# Altium schematic sheet R.SchDoc
size A4
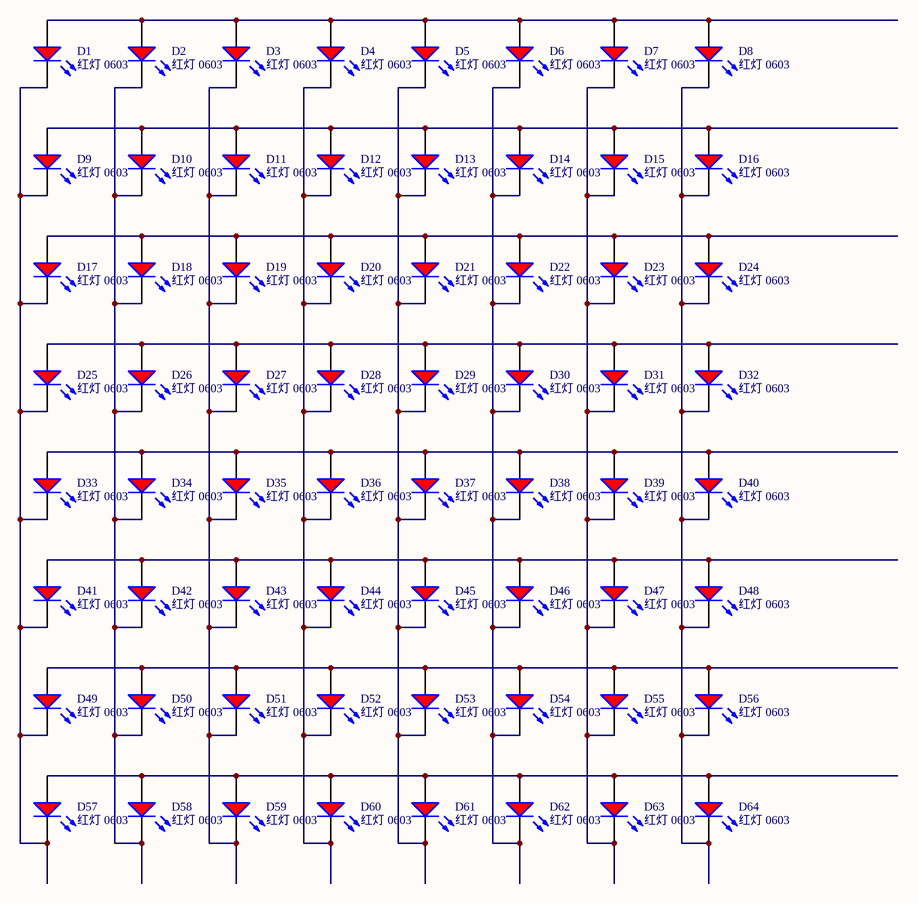
[diagram p0: R.SchDoc]

## Parts
D1  红灯 0603  [0603_LED_S1]
D2  红灯 0603  [0603_LED_S1]
D3  红灯 0603  [0603_LED_S1]
D4  红灯 0603  [0603_LED_S1]
D5  红灯 0603  [0603_LED_S1]
D6  红灯 0603  [0603_LED_S1]
D7  红灯 0603  [0603_LED_S1]
D8  红灯 0603  [0603_LED_S1]
D9  红灯 0603  [0603_LED_S1]
D10  红灯 0603  [0603_LED_S1]
D11  红灯 0603  [0603_LED_S1]
D12  红灯 0603  [0603_LED_S1]
D13  红灯 0603  [0603_LED_S1]
D14  红灯 0603  [0603_LED_S1]
D15  红灯 0603  [0603_LED_S1]
D16  红灯 0603  [0603_LED_S1]
D17  红灯 0603  [0603_LED_S1]
D18  红灯 0603  [0603_LED_S1]
D19  红灯 0603  [0603_LED_S1]
D20  红灯 0603  [0603_LED_S1]
D21  红灯 0603  [0603_LED_S1]
D22  红灯 0603  [0603_LED_S1]
D23  红灯 0603  [0603_LED_S1]
D24  红灯 0603  [0603_LED_S1]
D25  红灯 0603  [0603_LED_S1]
D26  红灯 0603  [0603_LED_S1]
D27  红灯 0603  [0603_LED_S1]
D28  红灯 0603  [0603_LED_S1]
D29  红灯 0603  [0603_LED_S1]
D30  红灯 0603  [0603_LED_S1]
D31  红灯 0603  [0603_LED_S1]
D32  红灯 0603  [0603_LED_S1]
D33  红灯 0603  [0603_LED_S1]
D34  红灯 0603  [0603_LED_S1]
D35  红灯 0603  [0603_LED_S1]
D36  红灯 0603  [0603_LED_S1]
D37  红灯 0603  [0603_LED_S1]
D38  红灯 0603  [0603_LED_S1]
D39  红灯 0603  [0603_LED_S1]
D40  红灯 0603  [0603_LED_S1]
D41  红灯 0603  [0603_LED_S1]
D42  红灯 0603  [0603_LED_S1]
D43  红灯 0603  [0603_LED_S1]
D44  红灯 0603  [0603_LED_S1]
D45  红灯 0603  [0603_LED_S1]
D46  红灯 0603  [0603_LED_S1]
D47  红灯 0603  [0603_LED_S1]
D48  红灯 0603  [0603_LED_S1]
D49  红灯 0603  [0603_LED_S1]
D50  红灯 0603  [0603_LED_S1]
D51  红灯 0603  [0603_LED_S1]
D52  红灯 0603  [0603_LED_S1]
D53  红灯 0603  [0603_LED_S1]
D54  红灯 0603  [0603_LED_S1]
D55  红灯 0603  [0603_LED_S1]
D56  红灯 0603  [0603_LED_S1]
D57  红灯 0603  [0603_LED_S1]
D58  红灯 0603  [0603_LED_S1]
D59  红灯 0603  [0603_LED_S1]
D60  红灯 0603  [0603_LED_S1]
D61  红灯 0603  [0603_LED_S1]
D62  红灯 0603  [0603_LED_S1]
D63  红灯 0603  [0603_LED_S1]
D64  红灯 0603  [0603_LED_S1]

## Nets
NetD1_A: D1.A D2.A D3.A D4.A D5.A D6.A D7.A D8.A
NetD1_K: D1.K D9.K D17.K D25.K D33.K D41.K D49.K D57.K
NetD2_K: D2.K D10.K D18.K D26.K D34.K D42.K D50.K D58.K
NetD3_K: D3.K D11.K D19.K D27.K D35.K D43.K D51.K D59.K
NetD4_K: D4.K D12.K D20.K D28.K D36.K D44.K D52.K D60.K
NetD5_K: D5.K D13.K D21.K D29.K D37.K D45.K D53.K D61.K
NetD6_K: D6.K D14.K D22.K D30.K D38.K D46.K D54.K D62.K
NetD7_K: D7.K D15.K D23.K D31.K D39.K D47.K D55.K D63.K
NetD8_K: D8.K D16.K D24.K D32.K D40.K D48.K D56.K D64.K
NetD9_A: D9.A D10.A D11.A D12.A D13.A D14.A D15.A D16.A
NetD17_A: D17.A D18.A D19.A D20.A D21.A D22.A D23.A D24.A
NetD25_A: D25.A D26.A D27.A D28.A D29.A D30.A D31.A D32.A
NetD33_A: D33.A D34.A D35.A D36.A D37.A D38.A D39.A D40.A
NetD41_A: D41.A D42.A D43.A D44.A D45.A D46.A D47.A D48.A
NetD49_A: D49.A D50.A D51.A D52.A D53.A D54.A D55.A D56.A
NetD57_A: D57.A D58.A D59.A D60.A D61.A D62.A D63.A D64.A

## Library data of the parts
D1-D64 = 0603 红灯: 发光二极管; ComponentLink1Description: 供应商链接; ComponentLink1URL: http://www.szlcsc.com/product/details_2659.html; Package: 0603; Supplier: LC; SuppliersPartNumber: C2286